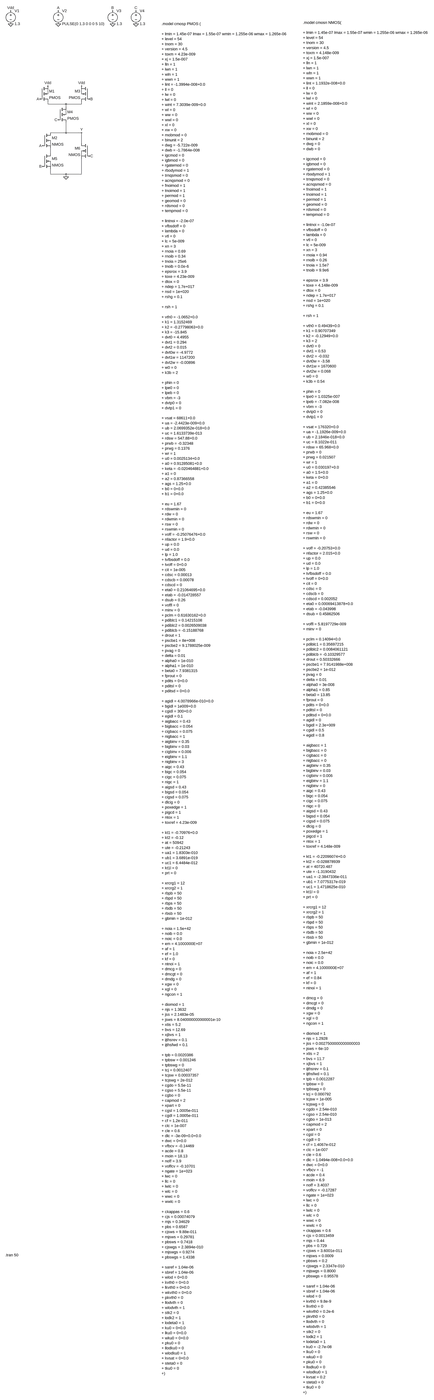
[diagram p0: schematic AOI21.asc, whole sheet]
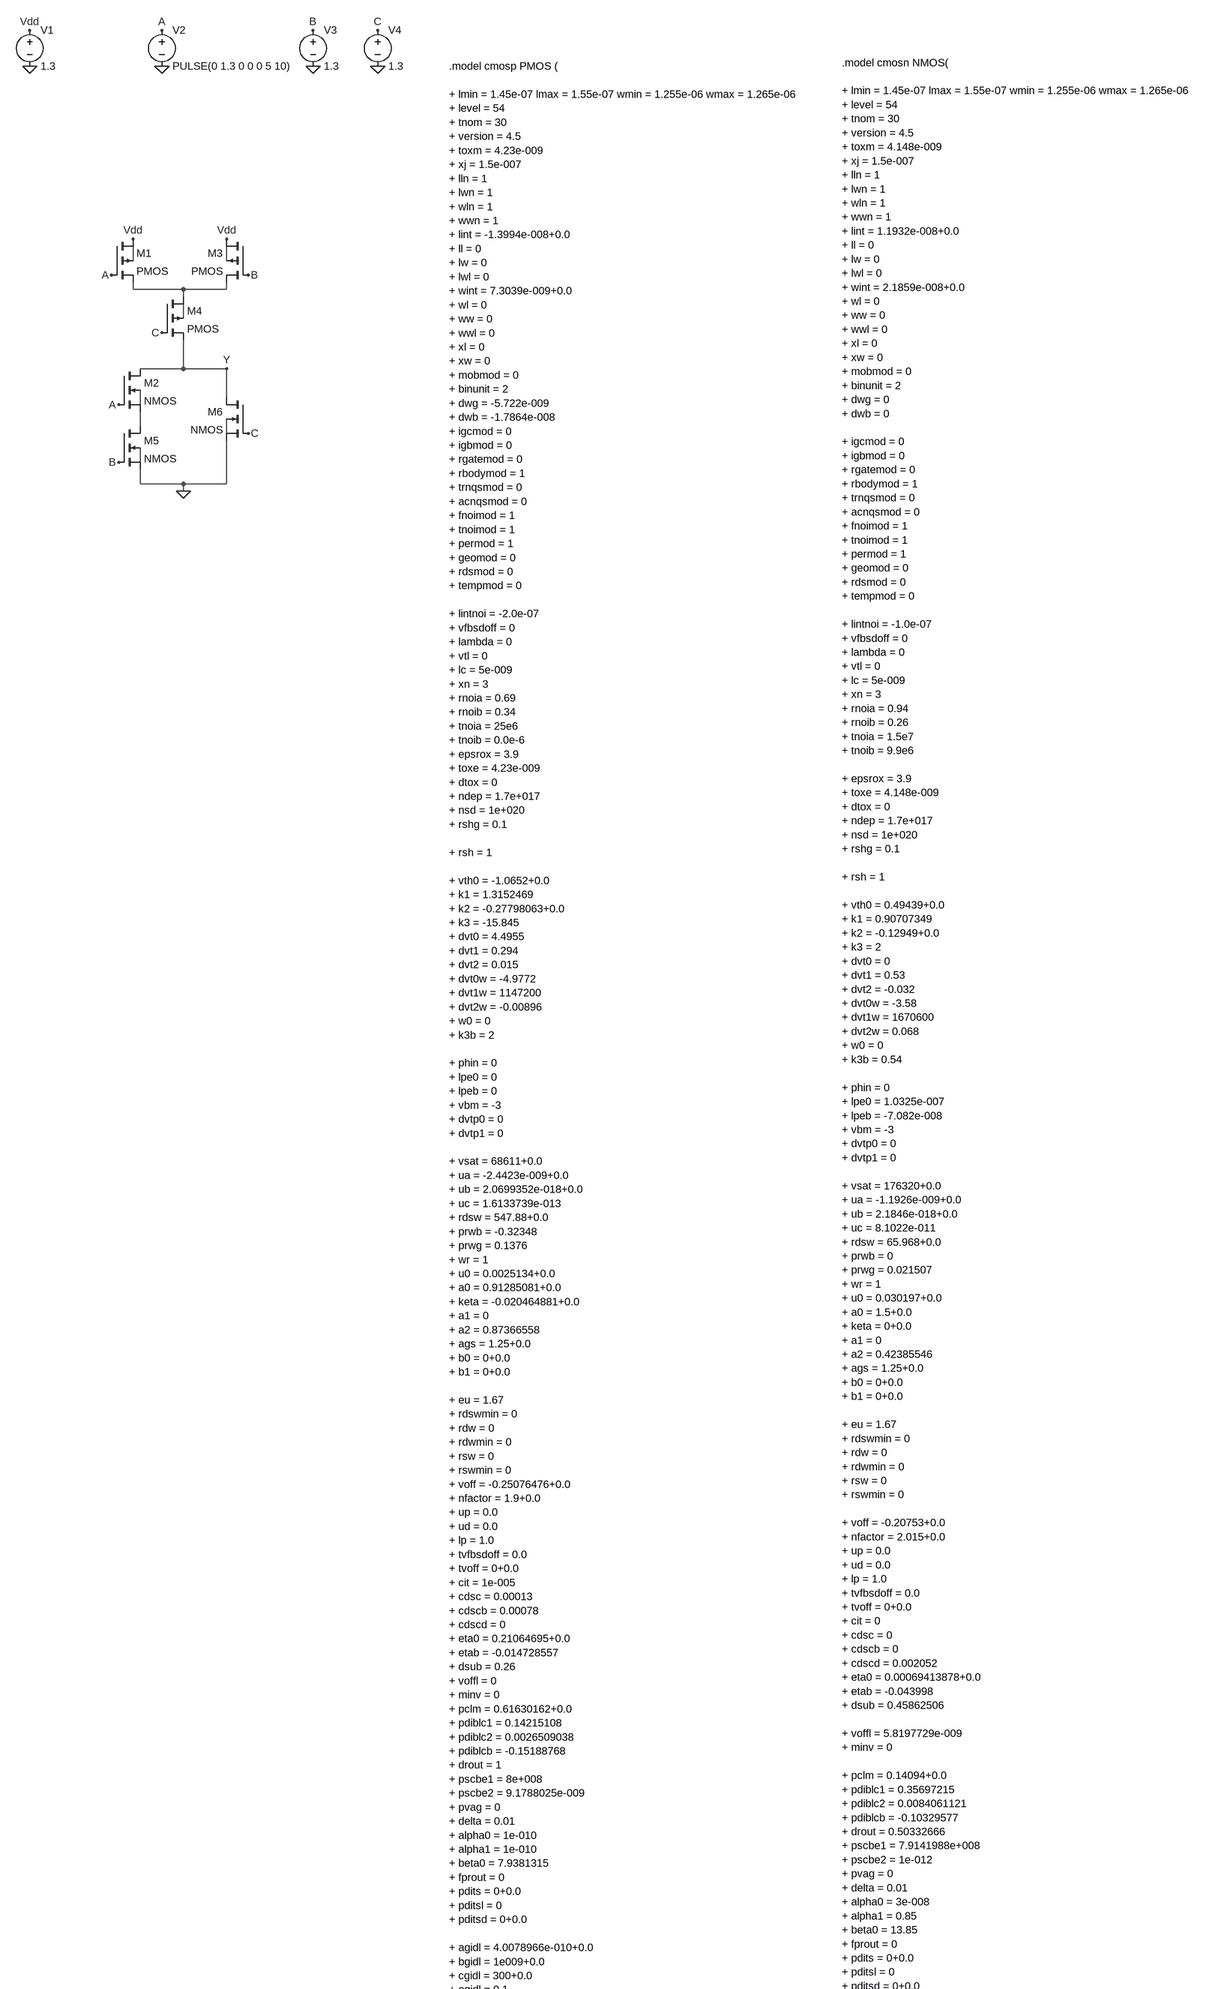
[diagram p1: schematic AOI21.asc, part, row 1 of 2, column 1 of 1]
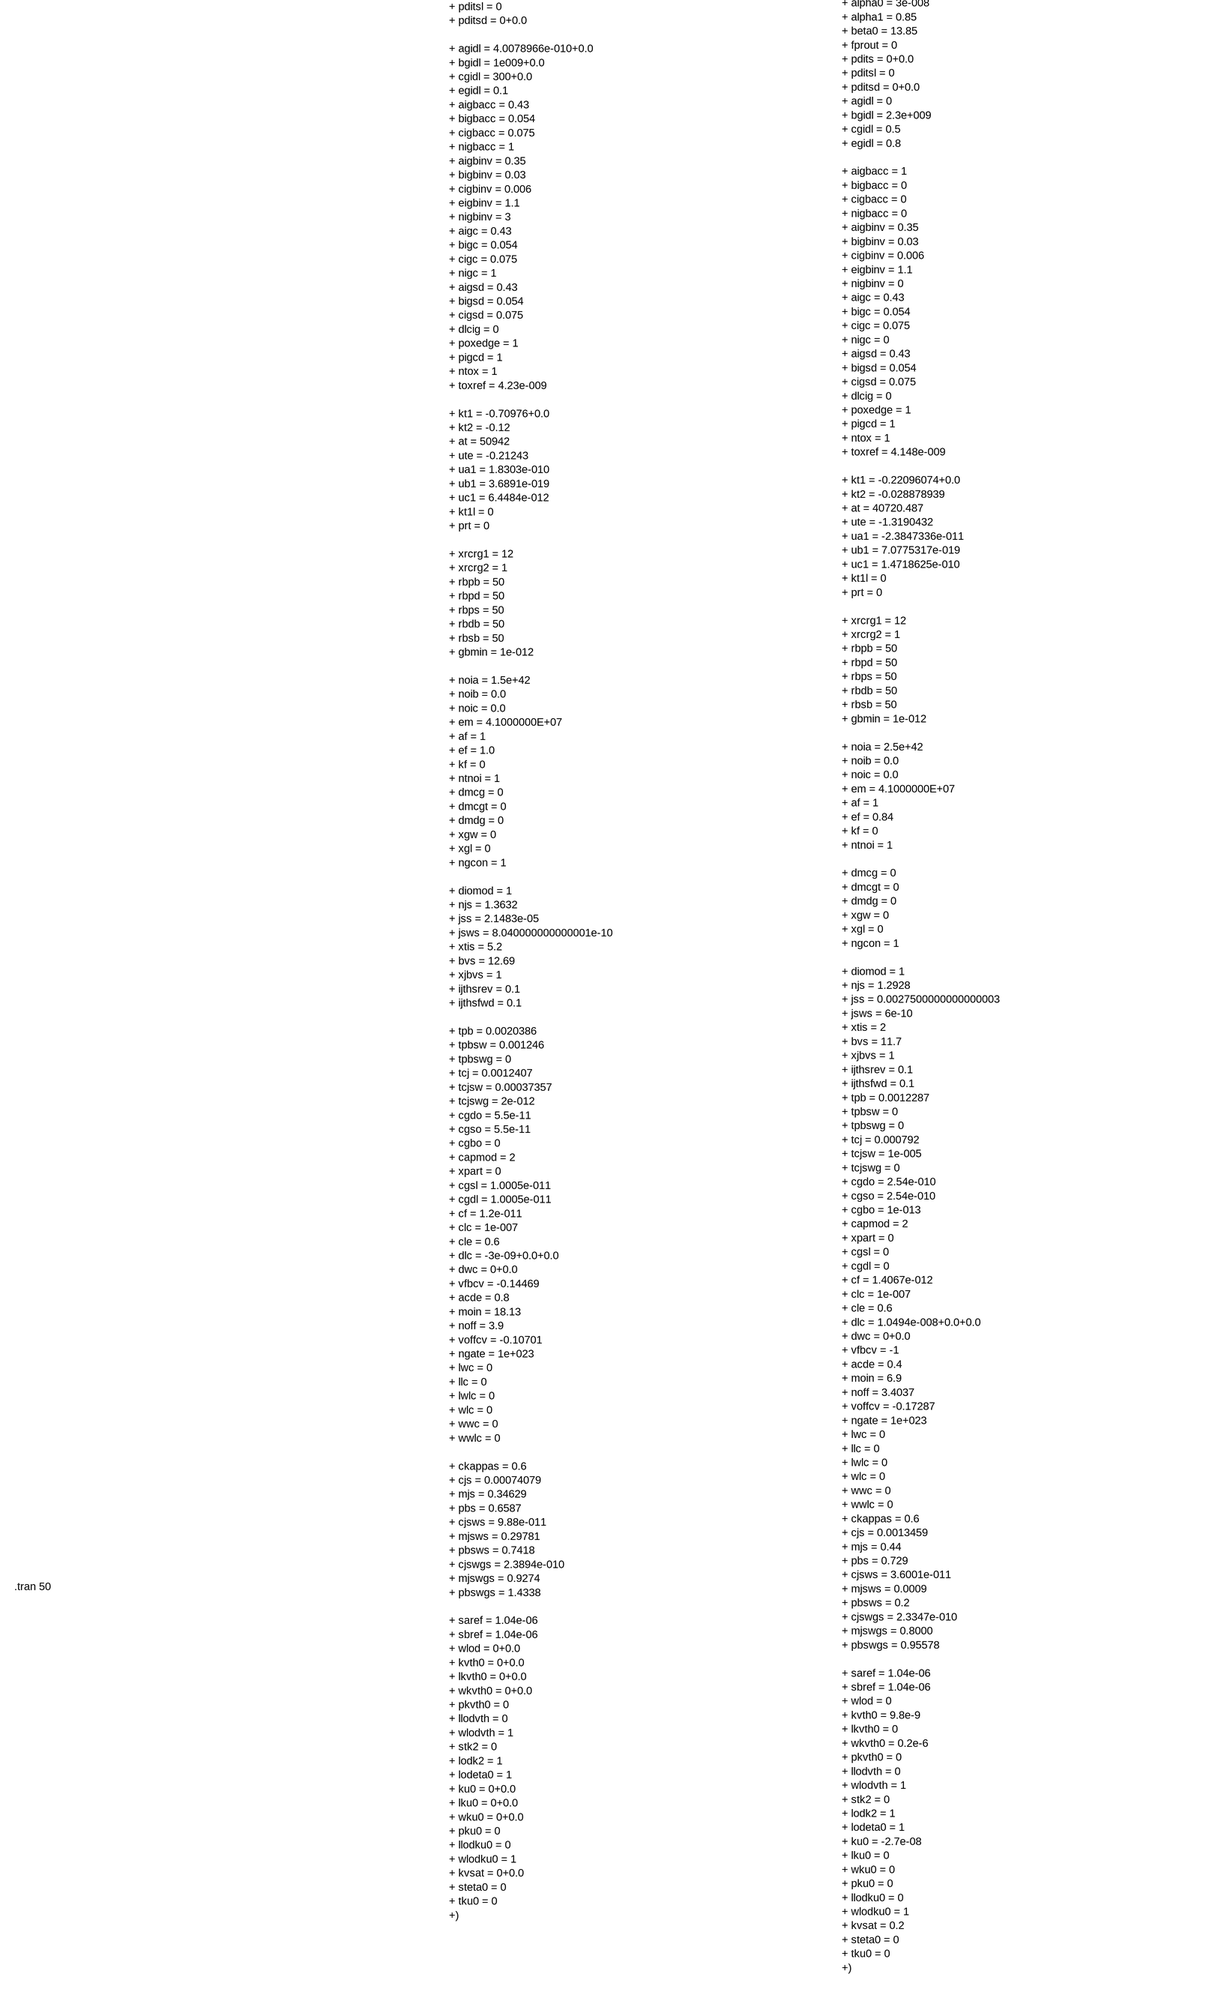
[diagram p2: schematic AOI21.asc, part, row 2 of 2, column 1 of 1]
AOI21.asc, the LTspice schematic file:
Version 4
SHEET 1 1216 7744
WIRE -2896 560 -2896 528
WIRE -2688 560 -2688 528
WIRE -2896 624 -2896 608
WIRE -2784 624 -2896 624
WIRE -2688 624 -2688 608
WIRE -2688 624 -2784 624
WIRE -2784 640 -2784 624
WIRE -2784 688 -2784 656
WIRE -2784 800 -2784 736
WIRE -2784 800 -2880 800
WIRE -2688 800 -2784 800
WIRE -2688 864 -2688 800
WIRE -2880 880 -2880 848
WIRE -2880 928 -2880 896
WIRE -2688 944 -2688 912
WIRE -2880 1008 -2880 976
WIRE -2880 1056 -2880 1024
WIRE -2784 1056 -2880 1056
WIRE -2688 1056 -2688 960
WIRE -2688 1056 -2784 1056
WIRE -2784 1072 -2784 1056
FLAG -3216 48 Vdd
FLAG -3216 128 0
FLAG -2832 48 A
FLAG -2832 128 0
FLAG -2496 48 B
FLAG -2496 128 0
FLAG -2352 48 C
FLAG -2352 128 0
FLAG -2784 1072 0
FLAG -2896 512 Vdd
FLAG -2688 512 Vdd
FLAG -2944 592 A
FLAG -2640 592 B
FLAG -2832 720 C
FLAG -2928 880 A
FLAG -2928 1008 B
FLAG -2640 944 C
FLAG -2688 800 Y
SYMBOL voltage -3216 32 R0
WINDOW 123 0 0 Left 0
WINDOW 39 0 0 Left 0
SYMATTR InstName V1
SYMATTR Value 1.3
SYMBOL voltage -2832 32 R0
WINDOW 123 0 0 Left 0
WINDOW 39 0 0 Left 0
SYMATTR InstName V2
SYMATTR Value PULSE(0 1.3 0 0 0 5 10)
SYMBOL voltage -2496 32 R0
WINDOW 123 0 0 Left 0
WINDOW 39 0 0 Left 0
SYMATTR InstName V3
SYMATTR Value 1.3
SYMBOL voltage -2352 32 R0
WINDOW 123 0 0 Left 0
WINDOW 39 0 0 Left 0
SYMATTR InstName V4
SYMATTR Value 1.3
SYMBOL pmos4 -2944 512 R0
SYMATTR InstName M1
SYMATTR Value2 l=0.13u w=4u
SYMBOL nmos4 -2928 800 R0
SYMATTR InstName M2
SYMATTR Value2 l=0.13u w=2u
SYMBOL pmos4 -2640 512 M0
SYMATTR InstName M3
SYMATTR Value2 l=0.13u w=4u
SYMBOL pmos4 -2832 640 R0
SYMATTR InstName M4
SYMATTR Value2 l=0.13u w=4u
SYMBOL nmos4 -2928 928 R0
SYMATTR InstName M5
SYMATTR Value2 l=0.13u w=2u
SYMBOL nmos4 -2640 864 M0
SYMATTR InstName M6
SYMATTR Value2 l=0.13u w=1u
TEXT 352 120 Left 2 !.model cmosn NMOS(\n \n+ lmin = 1.45e-07 lmax = 1.55e-07 wmin = 1.255e-06 wmax = 1.265e-06\n+ level = 54 \n+ tnom = 30 \n+ version = 4.5 \n+ toxm = 4.148e-009 \n+ xj = 1.5e-007 \n+ lln = 1 \n+ lwn = 1 \n+ wln = 1 \n+ wwn = 1 \n+ lint = 1.1932e-008+0.0 \n+ ll = 0 \n+ lw = 0 \n+ lwl = 0 \n+ wint = 2.1859e-008+0.0 \n+ wl = 0 \n+ ww = 0 \n+ wwl = 0 \n+ xl = 0 \n+ xw = 0 \n+ mobmod = 0 \n+ binunit = 2 \n+ dwg = 0 \n+ dwb = 0 \n \n+ igcmod = 0 \n+ igbmod = 0 \n+ rgatemod = 0 \n+ rbodymod = 1 \n+ trnqsmod = 0 \n+ acnqsmod = 0 \n+ fnoimod = 1 \n+ tnoimod = 1 \n+ permod = 1 \n+ geomod = 0 \n+ rdsmod = 0 \n+ tempmod = 0 \n \n+ lintnoi = -1.0e-07 \n+ vfbsdoff = 0 \n+ lambda = 0 \n+ vtl = 0 \n+ lc = 5e-009 \n+ xn = 3 \n+ rnoia = 0.94\n+ rnoib = 0.26\n+ tnoia = 1.5e7\n+ tnoib = 9.9e6\n \n+ epsrox = 3.9 \n+ toxe = 4.148e-009 \n+ dtox = 0 \n+ ndep = 1.7e+017 \n+ nsd = 1e+020 \n+ rshg = 0.1 \n \n+ rsh = 1 \n \n+ vth0 = 0.49439+0.0 \n+ k1 = 0.90707349 \n+ k2 = -0.12949+0.0 \n+ k3 = 2 \n+ dvt0 = 0 \n+ dvt1 = 0.53 \n+ dvt2 = -0.032 \n+ dvt0w = -3.58 \n+ dvt1w = 1670600 \n+ dvt2w = 0.068 \n+ w0 = 0 \n+ k3b = 0.54 \n \n+ phin = 0 \n+ lpe0 = 1.0325e-007 \n+ lpeb = -7.082e-008 \n+ vbm = -3 \n+ dvtp0 = 0 \n+ dvtp1 = 0 \n \n+ vsat = 176320+0.0 \n+ ua = -1.1926e-009+0.0 \n+ ub = 2.1846e-018+0.0 \n+ uc = 8.1022e-011 \n+ rdsw = 65.968+0.0 \n+ prwb = 0 \n+ prwg = 0.021507 \n+ wr = 1 \n+ u0 = 0.030197+0.0 \n+ a0 = 1.5+0.0 \n+ keta = 0+0.0 \n+ a1 = 0 \n+ a2 = 0.42385546 \n+ ags = 1.25+0.0 \n+ b0 = 0+0.0 \n+ b1 = 0+0.0 \n \n+ eu = 1.67 \n+ rdswmin = 0 \n+ rdw = 0 \n+ rdwmin = 0 \n+ rsw = 0 \n+ rswmin = 0 \n \n+ voff = -0.20753+0.0 \n+ nfactor = 2.015+0.0 \n+ up = 0.0\n+ ud = 0.0\n+ lp = 1.0\n+ tvfbsdoff = 0.0\n+ tvoff = 0+0.0\n+ cit = 0 \n+ cdsc = 0 \n+ cdscb = 0 \n+ cdscd = 0.002052 \n+ eta0 = 0.00069413878+0.0 \n+ etab = -0.043998 \n+ dsub = 0.45862506 \n \n+ voffl = 5.8197729e-009 \n+ minv = 0 \n \n+ pclm = 0.14094+0.0 \n+ pdiblc1 = 0.35697215 \n+ pdiblc2 = 0.0084061121 \n+ pdiblcb = -0.10329577 \n+ drout = 0.50332666 \n+ pscbe1 = 7.9141988e+008 \n+ pscbe2 = 1e-012 \n+ pvag = 0 \n+ delta = 0.01 \n+ alpha0 = 3e-008 \n+ alpha1 = 0.85 \n+ beta0 = 13.85 \n+ fprout = 0 \n+ pdits = 0+0.0 \n+ pditsl = 0 \n+ pditsd = 0+0.0 \n+ agidl = 0 \n+ bgidl = 2.3e+009 \n+ cgidl = 0.5 \n+ egidl = 0.8 \n \n+ aigbacc = 1 \n+ bigbacc = 0 \n+ cigbacc = 0 \n+ nigbacc = 0 \n+ aigbinv = 0.35 \n+ bigbinv = 0.03 \n+ cigbinv = 0.006 \n+ eigbinv = 1.1 \n+ nigbinv = 0 \n+ aigc = 0.43 \n+ bigc = 0.054 \n+ cigc = 0.075 \n+ nigc = 0 \n+ aigsd = 0.43 \n+ bigsd = 0.054 \n+ cigsd = 0.075 \n+ dlcig = 0 \n+ poxedge = 1 \n+ pigcd = 1 \n+ ntox = 1 \n+ toxref = 4.148e-009 \n \n+ kt1 = -0.22096074+0.0 \n+ kt2 = -0.028878939 \n+ at = 40720.487 \n+ ute = -1.3190432 \n+ ua1 = -2.3847336e-011 \n+ ub1 = 7.0775317e-019 \n+ uc1 = 1.4718625e-010 \n+ kt1l = 0 \n+ prt = 0 \n \n+ xrcrg1 = 12 \n+ xrcrg2 = 1 \n+ rbpb = 50 \n+ rbpd = 50 \n+ rbps = 50 \n+ rbdb = 50 \n+ rbsb = 50 \n+ gbmin = 1e-012 \n \n+ noia = 2.5e+42 \n+ noib = 0.0 \n+ noic = 0.0 \n+ em = 4.1000000E+07 \n+ af = 1 \n+ ef = 0.84 \n+ kf = 0 \n+ ntnoi = 1 \n \n+ dmcg = 0 \n+ dmcgt = 0 \n+ dmdg = 0 \n+ xgw = 0 \n+ xgl = 0 \n+ ngcon = 1 \n \n+ diomod = 1 \n+ njs = 1.2928 \n+ jss = 0.0027500000000000003 \n+ jsws = 6e-10 \n+ xtis = 2 \n+ bvs = 11.7 \n+ xjbvs = 1 \n+ ijthsrev = 0.1 \n+ ijthsfwd = 0.1 \n+ tpb = 0.0012287 \n+ tpbsw = 0 \n+ tpbswg = 0 \n+ tcj = 0.000792 \n+ tcjsw = 1e-005 \n+ tcjswg = 0 \n+ cgdo = 2.54e-010 \n+ cgso = 2.54e-010 \n+ cgbo = 1e-013 \n+ capmod = 2 \n+ xpart = 0 \n+ cgsl = 0 \n+ cgdl = 0 \n+ cf = 1.4067e-012 \n+ clc = 1e-007 \n+ cle = 0.6 \n+ dlc = 1.0494e-008+0.0+0.0 \n+ dwc = 0+0.0 \n+ vfbcv = -1 \n+ acde = 0.4 \n+ moin = 6.9 \n+ noff = 3.4037 \n+ voffcv = -0.17287 \n+ ngate = 1e+023 \n+ lwc = 0 \n+ llc = 0 \n+ lwlc = 0 \n+ wlc = 0 \n+ wwc = 0 \n+ wwlc = 0 \n+ ckappas = 0.6 \n+ cjs = 0.0013459 \n+ mjs = 0.44 \n+ pbs = 0.729 \n+ cjsws = 3.6001e-011 \n+ mjsws = 0.0009 \n+ pbsws = 0.2 \n+ cjswgs = 2.3347e-010 \n+ mjswgs = 0.8000 \n+ pbswgs = 0.95578 \n \n+ saref = 1.04e-06\n+ sbref = 1.04e-06\n+ wlod = 0\n+ kvth0 = 9.8e-9\n+ lkvth0 = 0\n+ wkvth0 = 0.2e-6\n+ pkvth0 = 0\n+ llodvth = 0\n+ wlodvth = 1\n+ stk2 = 0\n+ lodk2 = 1\n+ lodeta0 = 1\n+ ku0 = -2.7e-08\n+ lku0 = 0\n+ wku0 = 0\n+ pku0 = 0\n+ llodku0 = 0\n+ wlodku0 = 1\n+ kvsat = 0.2\n+ steta0 = 0\n+ tku0 = 0\n+)
TEXT -632 128 Left 2 !.model cmosp PMOS (\n \n+ lmin = 1.45e-07 lmax = 1.55e-07 wmin = 1.255e-06 wmax = 1.265e-06\n+ level = 54 \n+ tnom = 30 \n+ version = 4.5 \n+ toxm = 4.23e-009 \n+ xj = 1.5e-007 \n+ lln = 1 \n+ lwn = 1 \n+ wln = 1 \n+ wwn = 1 \n+ lint = -1.3994e-008+0.0 \n+ ll = 0 \n+ lw = 0 \n+ lwl = 0 \n+ wint = 7.3039e-009+0.0 \n+ wl = 0 \n+ ww = 0 \n+ wwl = 0 \n+ xl = 0 \n+ xw = 0 \n+ mobmod = 0 \n+ binunit = 2 \n+ dwg = -5.722e-009 \n+ dwb = -1.7864e-008 \n+ igcmod = 0 \n+ igbmod = 0 \n+ rgatemod = 0 \n+ rbodymod = 1 \n+ trnqsmod = 0 \n+ acnqsmod = 0 \n+ fnoimod = 1 \n+ tnoimod = 1 \n+ permod = 1 \n+ geomod = 0 \n+ rdsmod = 0 \n+ tempmod = 0 \n \n+ lintnoi = -2.0e-07 \n+ vfbsdoff = 0 \n+ lambda = 0 \n+ vtl = 0 \n+ lc = 5e-009 \n+ xn = 3 \n+ rnoia = 0.69 \n+ rnoib = 0.34 \n+ tnoia = 25e6 \n+ tnoib = 0.0e-6 \n+ epsrox = 3.9 \n+ toxe = 4.23e-009 \n+ dtox = 0 \n+ ndep = 1.7e+017 \n+ nsd = 1e+020 \n+ rshg = 0.1 \n \n+ rsh = 1 \n \n+ vth0 = -1.0652+0.0 \n+ k1 = 1.3152469 \n+ k2 = -0.27798063+0.0 \n+ k3 = -15.845 \n+ dvt0 = 4.4955 \n+ dvt1 = 0.294 \n+ dvt2 = 0.015 \n+ dvt0w = -4.9772 \n+ dvt1w = 1147200 \n+ dvt2w = -0.00896 \n+ w0 = 0 \n+ k3b = 2 \n \n+ phin = 0 \n+ lpe0 = 0 \n+ lpeb = 0 \n+ vbm = -3 \n+ dvtp0 = 0 \n+ dvtp1 = 0 \n \n+ vsat = 68611+0.0 \n+ ua = -2.4423e-009+0.0 \n+ ub = 2.0699352e-018+0.0 \n+ uc = 1.6133739e-013 \n+ rdsw = 547.88+0.0 \n+ prwb = -0.32348 \n+ prwg = 0.1376 \n+ wr = 1 \n+ u0 = 0.0025134+0.0 \n+ a0 = 0.91285081+0.0 \n+ keta = -0.020464881+0.0 \n+ a1 = 0 \n+ a2 = 0.87366558 \n+ ags = 1.25+0.0 \n+ b0 = 0+0.0 \n+ b1 = 0+0.0 \n \n+ eu = 1.67 \n+ rdswmin = 0 \n+ rdw = 0 \n+ rdwmin = 0 \n+ rsw = 0 \n+ rswmin = 0 \n+ voff = -0.25076476+0.0 \n+ nfactor = 1.9+0.0 \n+ up = 0.0\n+ ud = 0.0\n+ lp = 1.0\n+ tvfbsdoff = 0.0\n+ tvoff = 0+0.0\n+ cit = 1e-005 \n+ cdsc = 0.00013 \n+ cdscb = 0.00078 \n+ cdscd = 0 \n+ eta0 = 0.21064695+0.0 \n+ etab = -0.014728557 \n+ dsub = 0.26 \n+ voffl = 0 \n+ minv = 0 \n+ pclm = 0.61630162+0.0 \n+ pdiblc1 = 0.14215108 \n+ pdiblc2 = 0.0026509038 \n+ pdiblcb = -0.15188768 \n+ drout = 1 \n+ pscbe1 = 8e+008 \n+ pscbe2 = 9.1788025e-009 \n+ pvag = 0 \n+ delta = 0.01 \n+ alpha0 = 1e-010 \n+ alpha1 = 1e-010 \n+ beta0 = 7.9381315 \n+ fprout = 0 \n+ pdits = 0+0.0 \n+ pditsl = 0 \n+ pditsd = 0+0.0 \n \n+ agidl = 4.0078966e-010+0.0 \n+ bgidl = 1e009+0.0 \n+ cgidl = 300+0.0 \n+ egidl = 0.1 \n+ aigbacc = 0.43 \n+ bigbacc = 0.054 \n+ cigbacc = 0.075 \n+ nigbacc = 1 \n+ aigbinv = 0.35 \n+ bigbinv = 0.03 \n+ cigbinv = 0.006 \n+ eigbinv = 1.1 \n+ nigbinv = 3 \n+ aigc = 0.43 \n+ bigc = 0.054 \n+ cigc = 0.075 \n+ nigc = 1 \n+ aigsd = 0.43 \n+ bigsd = 0.054 \n+ cigsd = 0.075 \n+ dlcig = 0 \n+ poxedge = 1 \n+ pigcd = 1 \n+ ntox = 1 \n+ toxref = 4.23e-009 \n \n+ kt1 = -0.70976+0.0 \n+ kt2 = -0.12 \n+ at = 50942 \n+ ute = -0.21243 \n+ ua1 = 1.8303e-010 \n+ ub1 = 3.6891e-019 \n+ uc1 = 6.4484e-012 \n+ kt1l = 0 \n+ prt = 0 \n \n+ xrcrg1 = 12 \n+ xrcrg2 = 1 \n+ rbpb = 50 \n+ rbpd = 50 \n+ rbps = 50 \n+ rbdb = 50 \n+ rbsb = 50 \n+ gbmin = 1e-012 \n \n+ noia = 1.5e+42 \n+ noib = 0.0 \n+ noic = 0.0 \n+ em = 4.1000000E+07 \n+ af = 1 \n+ ef = 1.0 \n+ kf = 0 \n+ ntnoi = 1 \n+ dmcg = 0 \n+ dmcgt = 0 \n+ dmdg = 0 \n+ xgw = 0 \n+ xgl = 0 \n+ ngcon = 1 \n \n+ diomod = 1 \n+ njs = 1.3632 \n+ jss = 2.1483e-05 \n+ jsws = 8.040000000000001e-10 \n+ xtis = 5.2 \n+ bvs = 12.69 \n+ xjbvs = 1 \n+ ijthsrev = 0.1 \n+ ijthsfwd = 0.1 \n \n+ tpb = 0.0020386 \n+ tpbsw = 0.001246 \n+ tpbswg = 0 \n+ tcj = 0.0012407 \n+ tcjsw = 0.00037357 \n+ tcjswg = 2e-012 \n+ cgdo = 5.5e-11 \n+ cgso = 5.5e-11 \n+ cgbo = 0 \n+ capmod = 2 \n+ xpart = 0 \n+ cgsl = 1.0005e-011 \n+ cgdl = 1.0005e-011 \n+ cf = 1.2e-011 \n+ clc = 1e-007 \n+ cle = 0.6 \n+ dlc = -3e-09+0.0+0.0 \n+ dwc = 0+0.0 \n+ vfbcv = -0.14469 \n+ acde = 0.8 \n+ moin = 18.13 \n+ noff = 3.9 \n+ voffcv = -0.10701 \n+ ngate = 1e+023 \n+ lwc = 0 \n+ llc = 0 \n+ lwlc = 0 \n+ wlc = 0 \n+ wwc = 0 \n+ wwlc = 0 \n \n+ ckappas = 0.6 \n+ cjs = 0.00074079 \n+ mjs = 0.34629 \n+ pbs = 0.6587 \n+ cjsws = 9.88e-011 \n+ mjsws = 0.29781 \n+ pbsws = 0.7418 \n+ cjswgs = 2.3894e-010 \n+ mjswgs = 0.9274 \n+ pbswgs = 1.4338 \n \n+ saref = 1.04e-06\n+ sbref = 1.04e-06\n+ wlod = 0+0.0\n+ kvth0 = 0+0.0\n+ lkvth0 = 0+0.0\n+ wkvth0 = 0+0.0\n+ pkvth0 = 0\n+ llodvth = 0\n+ wlodvth = 1\n+ stk2 = 0\n+ lodk2 = 1\n+ lodeta0 = 1\n+ ku0 = 0+0.0\n+ lku0 = 0+0.0\n+ wku0 = 0+0.0\n+ pku0 = 0\n+ llodku0 = 0\n+ wlodku0 = 1\n+ kvsat = 0+0.0\n+ steta0 = 0\n+ tku0 = 0\n+)
TEXT -3250 7728 Left 2 !.tran 50

The netlist it stands for:
* AOI21.asc
V1 Vdd 0 1.3
V2 A 0 PULSE(0 1.3 0 0 0 5 10)
V3 B 0 1.3
V4 C 0 1.3
M1 Vdd A N003 N001 PMOS l=0.13u w=4u
M2 Y A N006 N005 NMOS l=0.13u w=2u
M3 Vdd B N003 N002 PMOS l=0.13u w=4u
M4 N003 C Y N004 PMOS l=0.13u w=4u
M5 N006 B 0 N008 NMOS l=0.13u w=2u
M6 Y C 0 N007 NMOS l=0.13u w=1u
.model NMOS NMOS
.model PMOS PMOS
.lib standard.mos
.model cmosn NMOS(
+ lmin = 1.45e-07 lmax = 1.55e-07 wmin = 1.255e-06 wmax = 1.265e-06
+ level = 54
+ tnom = 30
+ version = 4.5
+ toxm = 4.148e-009
+ xj = 1.5e-007
+ lln = 1
+ lwn = 1
+ wln = 1
+ wwn = 1
+ lint = 1.1932e-008+0.0
+ ll = 0
+ lw = 0
+ lwl = 0
+ wint = 2.1859e-008+0.0
+ wl = 0
+ ww = 0
+ wwl = 0
+ xl = 0
+ xw = 0
+ mobmod = 0
+ binunit = 2
+ dwg = 0
+ dwb = 0
+ igcmod = 0
+ igbmod = 0
+ rgatemod = 0
+ rbodymod = 1
+ trnqsmod = 0
+ acnqsmod = 0
+ fnoimod = 1
+ tnoimod = 1
+ permod = 1
+ geomod = 0
+ rdsmod = 0
+ tempmod = 0
+ lintnoi = -1.0e-07
+ vfbsdoff = 0
+ lambda = 0
+ vtl = 0
+ lc = 5e-009
+ xn = 3
+ rnoia = 0.94
+ rnoib = 0.26
+ tnoia = 1.5e7
+ tnoib = 9.9e6
+ epsrox = 3.9
+ toxe = 4.148e-009
+ dtox = 0
+ ndep = 1.7e+017
+ nsd = 1e+020
+ rshg = 0.1
+ rsh = 1
+ vth0 = 0.49439+0.0
+ k1 = 0.90707349
+ k2 = -0.12949+0.0
+ k3 = 2
+ dvt0 = 0
+ dvt1 = 0.53
+ dvt2 = -0.032
+ dvt0w = -3.58
+ dvt1w = 1670600
+ dvt2w = 0.068
+ w0 = 0
+ k3b = 0.54
+ phin = 0
+ lpe0 = 1.0325e-007
+ lpeb = -7.082e-008
+ vbm = -3
+ dvtp0 = 0
+ dvtp1 = 0
+ vsat = 176320+0.0
+ ua = -1.1926e-009+0.0
+ ub = 2.1846e-018+0.0
+ uc = 8.1022e-011
+ rdsw = 65.968+0.0
+ prwb = 0
+ prwg = 0.021507
+ wr = 1
+ u0 = 0.030197+0.0
+ a0 = 1.5+0.0
+ keta = 0+0.0
+ a1 = 0
+ a2 = 0.42385546
+ ags = 1.25+0.0
+ b0 = 0+0.0
+ b1 = 0+0.0
+ eu = 1.67
+ rdswmin = 0
+ rdw = 0
+ rdwmin = 0
+ rsw = 0
+ rswmin = 0
+ voff = -0.20753+0.0
+ nfactor = 2.015+0.0
+ up = 0.0
+ ud = 0.0
+ lp = 1.0
+ tvfbsdoff = 0.0
+ tvoff = 0+0.0
+ cit = 0
+ cdsc = 0
+ cdscb = 0
+ cdscd = 0.002052
+ eta0 = 0.00069413878+0.0
+ etab = -0.043998
+ dsub = 0.45862506
+ voffl = 5.8197729e-009
+ minv = 0
+ pclm = 0.14094+0.0
+ pdiblc1 = 0.35697215
+ pdiblc2 = 0.0084061121
+ pdiblcb = -0.10329577
+ drout = 0.50332666
+ pscbe1 = 7.9141988e+008
+ pscbe2 = 1e-012
+ pvag = 0
+ delta = 0.01
+ alpha0 = 3e-008
+ alpha1 = 0.85
+ beta0 = 13.85
+ fprout = 0
+ pdits = 0+0.0
+ pditsl = 0
+ pditsd = 0+0.0
+ agidl = 0
+ bgidl = 2.3e+009
+ cgidl = 0.5
+ egidl = 0.8
+ aigbacc = 1
+ bigbacc = 0
+ cigbacc = 0
+ nigbacc = 0
+ aigbinv = 0.35
+ bigbinv = 0.03
+ cigbinv = 0.006
+ eigbinv = 1.1
+ nigbinv = 0
+ aigc = 0.43
+ bigc = 0.054
+ cigc = 0.075
+ nigc = 0
+ aigsd = 0.43
+ bigsd = 0.054
+ cigsd = 0.075
+ dlcig = 0
+ poxedge = 1
+ pigcd = 1
+ ntox = 1
+ toxref = 4.148e-009
+ kt1 = -0.22096074+0.0
+ kt2 = -0.028878939
+ at = 40720.487
+ ute = -1.3190432
+ ua1 = -2.3847336e-011
+ ub1 = 7.0775317e-019
+ uc1 = 1.4718625e-010
+ kt1l = 0
+ prt = 0
+ xrcrg1 = 12
+ xrcrg2 = 1
+ rbpb = 50
+ rbpd = 50
+ rbps = 50
+ rbdb = 50
+ rbsb = 50
+ gbmin = 1e-012
+ noia = 2.5e+42
+ noib = 0.0
+ noic = 0.0
+ em = 4.1000000E+07
+ af = 1
+ ef = 0.84
+ kf = 0
+ ntnoi = 1
+ dmcg = 0
+ dmcgt = 0
+ dmdg = 0
+ xgw = 0
+ xgl = 0
+ ngcon = 1
+ diomod = 1
+ njs = 1.2928
+ jss = 0.0027500000000000003
+ jsws = 6e-10
+ xtis = 2
+ bvs = 11.7
+ xjbvs = 1
+ ijthsrev = 0.1
+ ijthsfwd = 0.1
+ tpb = 0.0012287
+ tpbsw = 0
+ tpbswg = 0
+ tcj = 0.000792
+ tcjsw = 1e-005
+ tcjswg = 0
+ cgdo = 2.54e-010
+ cgso = 2.54e-010
+ cgbo = 1e-013
+ capmod = 2
+ xpart = 0
+ cgsl = 0
+ cgdl = 0
+ cf = 1.4067e-012
+ clc = 1e-007
+ cle = 0.6
+ dlc = 1.0494e-008+0.0+0.0
+ dwc = 0+0.0
+ vfbcv = -1
+ acde = 0.4
+ moin = 6.9
+ noff = 3.4037
+ voffcv = -0.17287
+ ngate = 1e+023
+ lwc = 0
+ llc = 0
+ lwlc = 0
+ wlc = 0
+ wwc = 0
+ wwlc = 0
+ ckappas = 0.6
+ cjs = 0.0013459
+ mjs = 0.44
+ pbs = 0.729
+ cjsws = 3.6001e-011
+ mjsws = 0.0009
+ pbsws = 0.2
+ cjswgs = 2.3347e-010
+ mjswgs = 0.8000
+ pbswgs = 0.95578
+ saref = 1.04e-06
+ sbref = 1.04e-06
+ wlod = 0
+ kvth0 = 9.8e-9
+ lkvth0 = 0
+ wkvth0 = 0.2e-6
+ pkvth0 = 0
+ llodvth = 0
+ wlodvth = 1
+ stk2 = 0
+ lodk2 = 1
+ lodeta0 = 1
+ ku0 = -2.7e-08
+ lku0 = 0
+ wku0 = 0
+ pku0 = 0
+ llodku0 = 0
+ wlodku0 = 1
+ kvsat = 0.2
+ steta0 = 0
+ tku0 = 0
+)
.model cmosp PMOS (
+ lmin = 1.45e-07 lmax = 1.55e-07 wmin = 1.255e-06 wmax = 1.265e-06
+ level = 54
+ tnom = 30
+ version = 4.5
+ toxm = 4.23e-009
+ xj = 1.5e-007
+ lln = 1
+ lwn = 1
+ wln = 1
+ wwn = 1
+ lint = -1.3994e-008+0.0
+ ll = 0
+ lw = 0
+ lwl = 0
+ wint = 7.3039e-009+0.0
+ wl = 0
+ ww = 0
+ wwl = 0
+ xl = 0
+ xw = 0
+ mobmod = 0
+ binunit = 2
+ dwg = -5.722e-009
+ dwb = -1.7864e-008
+ igcmod = 0
+ igbmod = 0
+ rgatemod = 0
+ rbodymod = 1
+ trnqsmod = 0
+ acnqsmod = 0
+ fnoimod = 1
+ tnoimod = 1
+ permod = 1
+ geomod = 0
+ rdsmod = 0
+ tempmod = 0
+ lintnoi = -2.0e-07
+ vfbsdoff = 0
+ lambda = 0
+ vtl = 0
+ lc = 5e-009
+ xn = 3
+ rnoia = 0.69
+ rnoib = 0.34
+ tnoia = 25e6
+ tnoib = 0.0e-6
+ epsrox = 3.9
+ toxe = 4.23e-009
+ dtox = 0
+ ndep = 1.7e+017
+ nsd = 1e+020
+ rshg = 0.1
+ rsh = 1
+ vth0 = -1.0652+0.0
+ k1 = 1.3152469
+ k2 = -0.27798063+0.0
+ k3 = -15.845
+ dvt0 = 4.4955
+ dvt1 = 0.294
+ dvt2 = 0.015
+ dvt0w = -4.9772
+ dvt1w = 1147200
+ dvt2w = -0.00896
+ w0 = 0
+ k3b = 2
+ phin = 0
+ lpe0 = 0
+ lpeb = 0
+ vbm = -3
+ dvtp0 = 0
+ dvtp1 = 0
+ vsat = 68611+0.0
+ ua = -2.4423e-009+0.0
+ ub = 2.0699352e-018+0.0
+ uc = 1.6133739e-013
+ rdsw = 547.88+0.0
+ prwb = -0.32348
+ prwg = 0.1376
+ wr = 1
+ u0 = 0.0025134+0.0
+ a0 = 0.91285081+0.0
+ keta = -0.020464881+0.0
+ a1 = 0
+ a2 = 0.87366558
+ ags = 1.25+0.0
+ b0 = 0+0.0
+ b1 = 0+0.0
+ eu = 1.67
+ rdswmin = 0
+ rdw = 0
+ rdwmin = 0
+ rsw = 0
+ rswmin = 0
+ voff = -0.25076476+0.0
+ nfactor = 1.9+0.0
+ up = 0.0
+ ud = 0.0
+ lp = 1.0
+ tvfbsdoff = 0.0
+ tvoff = 0+0.0
+ cit = 1e-005
+ cdsc = 0.00013
+ cdscb = 0.00078
+ cdscd = 0
+ eta0 = 0.21064695+0.0
+ etab = -0.014728557
+ dsub = 0.26
+ voffl = 0
+ minv = 0
+ pclm = 0.61630162+0.0
+ pdiblc1 = 0.14215108
+ pdiblc2 = 0.0026509038
+ pdiblcb = -0.15188768
+ drout = 1
+ pscbe1 = 8e+008
+ pscbe2 = 9.1788025e-009
+ pvag = 0
+ delta = 0.01
+ alpha0 = 1e-010
+ alpha1 = 1e-010
+ beta0 = 7.9381315
+ fprout = 0
+ pdits = 0+0.0
+ pditsl = 0
+ pditsd = 0+0.0
+ agidl = 4.0078966e-010+0.0
+ bgidl = 1e009+0.0
+ cgidl = 300+0.0
+ egidl = 0.1
+ aigbacc = 0.43
+ bigbacc = 0.054
+ cigbacc = 0.075
+ nigbacc = 1
+ aigbinv = 0.35
+ bigbinv = 0.03
+ cigbinv = 0.006
+ eigbinv = 1.1
+ nigbinv = 3
+ aigc = 0.43
+ bigc = 0.054
+ cigc = 0.075
+ nigc = 1
+ aigsd = 0.43
+ bigsd = 0.054
+ cigsd = 0.075
+ dlcig = 0
+ poxedge = 1
+ pigcd = 1
+ ntox = 1
+ toxref = 4.23e-009
+ kt1 = -0.70976+0.0
+ kt2 = -0.12
+ at = 50942
+ ute = -0.21243
+ ua1 = 1.8303e-010
+ ub1 = 3.6891e-019
+ uc1 = 6.4484e-012
+ kt1l = 0
+ prt = 0
+ xrcrg1 = 12
+ xrcrg2 = 1
+ rbpb = 50
+ rbpd = 50
+ rbps = 50
+ rbdb = 50
+ rbsb = 50
+ gbmin = 1e-012
+ noia = 1.5e+42
+ noib = 0.0
+ noic = 0.0
+ em = 4.1000000E+07
+ af = 1
+ ef = 1.0
+ kf = 0
+ ntnoi = 1
+ dmcg = 0
+ dmcgt = 0
+ dmdg = 0
+ xgw = 0
+ xgl = 0
+ ngcon = 1
+ diomod = 1
+ njs = 1.3632
+ jss = 2.1483e-05
+ jsws = 8.040000000000001e-10
+ xtis = 5.2
+ bvs = 12.69
+ xjbvs = 1
+ ijthsrev = 0.1
+ ijthsfwd = 0.1
+ tpb = 0.0020386
+ tpbsw = 0.001246
+ tpbswg = 0
+ tcj = 0.0012407
+ tcjsw = 0.00037357
+ tcjswg = 2e-012
+ cgdo = 5.5e-11
+ cgso = 5.5e-11
+ cgbo = 0
+ capmod = 2
+ xpart = 0
+ cgsl = 1.0005e-011
+ cgdl = 1.0005e-011
+ cf = 1.2e-011
+ clc = 1e-007
+ cle = 0.6
+ dlc = -3e-09+0.0+0.0
+ dwc = 0+0.0
+ vfbcv = -0.14469
+ acde = 0.8
+ moin = 18.13
+ noff = 3.9
+ voffcv = -0.10701
+ ngate = 1e+023
+ lwc = 0
+ llc = 0
+ lwlc = 0
+ wlc = 0
+ wwc = 0
+ wwlc = 0
+ ckappas = 0.6
+ cjs = 0.00074079
+ mjs = 0.34629
+ pbs = 0.6587
+ cjsws = 9.88e-011
+ mjsws = 0.29781
+ pbsws = 0.7418
+ cjswgs = 2.3894e-010
+ mjswgs = 0.9274
+ pbswgs = 1.4338
+ saref = 1.04e-06
+ sbref = 1.04e-06
+ wlod = 0+0.0
+ kvth0 = 0+0.0
+ lkvth0 = 0+0.0
+ wkvth0 = 0+0.0
+ pkvth0 = 0
+ llodvth = 0
+ wlodvth = 1
+ stk2 = 0
+ lodk2 = 1
+ lodeta0 = 1
+ ku0 = 0+0.0
+ lku0 = 0+0.0
+ wku0 = 0+0.0
+ pku0 = 0
+ llodku0 = 0
+ wlodku0 = 1
+ kvsat = 0+0.0
+ steta0 = 0
+ tku0 = 0
+)
.tran 50
.backanno
.end